# Altium schematic sheet power_supply.SchDoc
size A; SheetNumber: 3; SheetTotal: 4
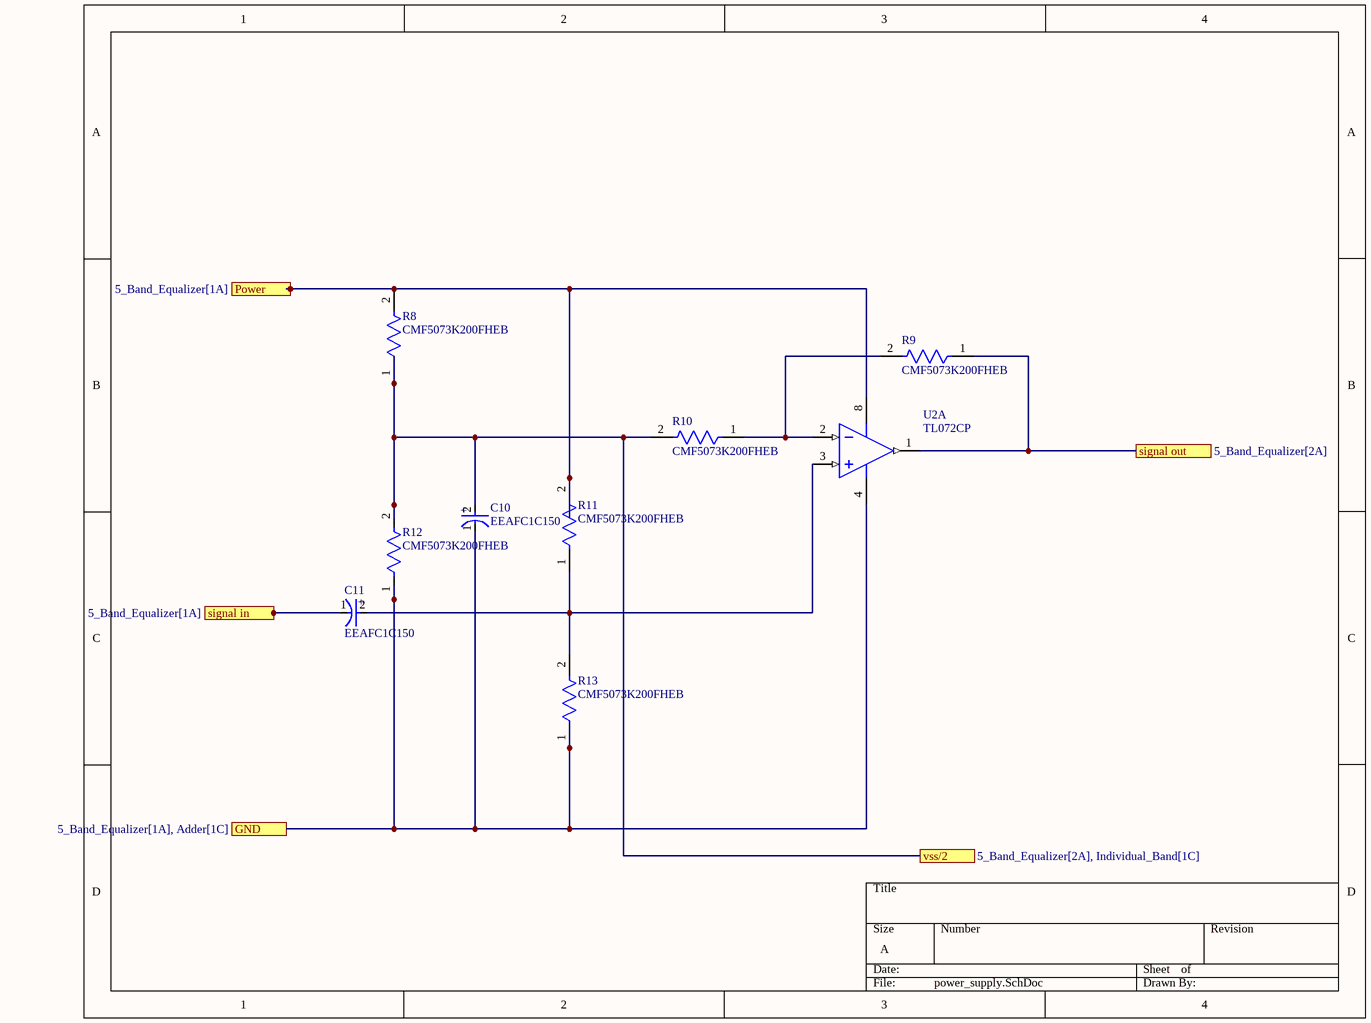
[diagram p0: power_supply.SchDoc]

## Parts
C10  EEAFC1C150  [FP-RAD-TH-D_4_0_5-L_7_1-F-MFG]
C11  EEAFC1C150  [FP-RAD-TH-D_4_0_5-L_7_1-F-MFG]
R8  CMF5073K200FHEB  [FP-CMF50-0]
R9  CMF5073K200FHEB  [FP-CMF50-0]
R10  CMF5073K200FHEB  [FP-CMF50-0]
R11  CMF5073K200FHEB  [FP-CMF50-0]
R12  CMF5073K200FHEB  [FP-CMF50-0]
R13  CMF5073K200FHEB  [FP-CMF50-0]
U2  TL072CP  [P0008A]  (part A of 2)

## Ports
GND (see 5_Band_Equalizer[1A], Adder[1C]), Power (see 5_Band_Equalizer[1A]), signal in (see 5_Band_Equalizer[1A]), signal out (see 5_Band_Equalizer[2A]), vss/2 (see 5_Band_Equalizer[2A], Individual_Band[1C])

## Nets
GND: C10.1(C) R12.1 R13.1 U2.4(VCC-) ; port GND
Power: R8.2 R11.2 U2.8(VCC+) ; port Power
signal in: C11.1(C) ; port signal in
signal out: R9.1 U2.1(OUT1) ; port signal out
vss/2: C10.2(A) R8.1 R10.2 R12.2 ; port vss/2
NetC11_2: C11.2(A) R11.1 R13.2 U2.3(IN1+)
NetR9_2: R9.2 R10.1 U2.2(IN1-)

## Notes on the sheet
- (in symbol CMP-05427-001559-1) +

## Library data of the parts
C10 C11 = CMP-05427-001559-1: Aluminum Electrolytic Capacitors (Radial Lead Type) AEC-Q200 Qualified 15uF ±20% 16V; Life (Hours): 1000Hour; Ripple Current: 65mA; ESR (Equivalent Series Resistance): 2R; Leakage Current: 3uA; Lead Diameter: 0.45mm; Construction: RADIAL; Mount: Through Hole; Voltage Rating: 16V; Radiation Hardening: No; Case/Package: Radial; Length: 7mm; Diameter: 4mm; Min Operating Temperature: -55°C; Voltage: 16V; Height - Seated (Max): 0.315inch; Voltage Rating (DC): 16V; Tolerance: 20%; Lead Pitch: 1.5mm; Height: 7mm; Impedance: 2R; Capacitance: 15uF; Termination: Radial; Packaging: Bulk; RoHS Compliant: Yes; Series: FC; Package Quantity: 200; Max Operating Temperature: 105°C
R8-R13 = CMP-00030-44386654-1: CMF5073K200FHEB Res Metal Film 73.2K Ohm 1% 0.125W(1/8W) ±50ppm/°C Epoxy AXL T/R; Max Power Dissipation: 250mW; Voltage Rating: 200V; Power Rating: 125mW; Resistance: 73.2kΩ; Tolerance: 1%; Width: 1.65mm; Length: 3.81mm; Schedule B: 8533210090, 8533210090; Termination: Axial; Lead Free: Lead Free; Diameter: 1.65mm; Voltage Rating (DC): 200V; NexarPartId: 44386654; Packaging: Cut Tape; Max Operating Temperature: 175°C; Composition: Metal Film; RoHS: Compliant; Mount: Through Hole; Features: Flame Retardant Coating, Moisture Resistant; Number of Terminations: 2; Temperature Coefficient: 50ppm/°C; Min Operating Temperature: -55°C; Case/Package: Axial
U2 = CMP-0017-00950-2: Dual Low-Noise JFET-Input General-Purpose Operational Amplifier, 7 to 36 V, 0 to 70 degC, 8-pin DIP (P8), Pb-Free (RoHS); Manufacturer: Texas Instruments; Sub Family: General Purpose Amplifier, High Supply Voltage Amplifier (>=30V); Total Supply Voltage(Max)(+5V is 5, +/-5V is 10): 36; Slew Rate(Typ)(V/us): 13; Vn at 1kHz(Typ)(nV/rtHz): 18; GBW(Typ)(MHz): 3; CMRR(Min)(dB): 70; Total Supply Voltage(Min)(+5V is 5, +/-5V is 10): 7; Vio (25C)(Max)(mV): 10; Rating: Catalog; IIB(Max)(pA): 200; Iq per channel(Max)(mA): 2.5; Number of Channels: 2; Mounting Technology: Through Hole; ComponentLink3Description: Package Specification; PartNumber: TL072CP; PackageVersion: 4040082/E, 04/2010; Eco-Plan: Pb-Free (RoHS); DatasheetVersion: SLOS080J; Offset Drift(Typ)(uV/C): 18; ComponentLink3URL: http://www.ti.com/litv/pdf/mpdi001b; PackageDescription: 8-Pin Plastic In-Line, Body 9.59 x 6.35 mm, Pitch 2.54 mm; Code_JEDEC: MS-001; ComponentLink2URL: http://www.ti.com/lit/ds/symlink/tl072.pdf; ComponentLink1Description: Manufacturer URL; ComponentLink2Description: Datasheet; ComponentLink1URL: http://www.ti.com/; PackageReference: P0008A